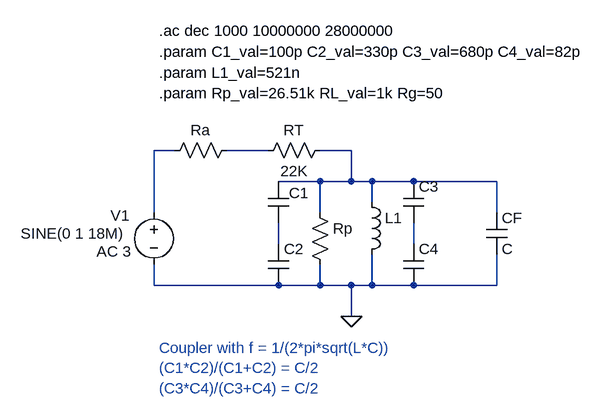
[diagram p0: schematic editable_coupler.asc]
editable_coupler.asc, the LTspice schematic file:
Version 4.1
SHEET 1 1576 680
WIRE 80 32 48 32
WIRE 224 32 160 32
WIRE 352 32 304 32
WIRE 304 80 240 80
WIRE 352 80 352 32
WIRE 352 80 304 80
WIRE 384 80 352 80
WIRE 448 80 384 80
WIRE 576 80 448 80
WIRE 384 112 384 80
WIRE 48 128 48 32
WIRE 304 128 304 80
WIRE 576 128 576 80
WIRE 240 176 240 144
WIRE 448 176 448 144
WIRE 48 240 48 208
WIRE 240 240 48 240
WIRE 304 240 304 208
WIRE 304 240 240 240
WIRE 352 240 304 240
WIRE 384 240 384 192
WIRE 384 240 352 240
WIRE 448 240 384 240
WIRE 576 240 576 192
WIRE 576 240 448 240
WIRE 352 288 352 240
FLAG 352 288 0
SYMBOL ind 368 96 R0
WINDOW 3 36 80 Invisible 2
SYMATTR Value 521n
SYMATTR InstName L1
SYMBOL cap 224 80 R0
WINDOW 0 32 18 Left 2
WINDOW 3 24 56 Invisible 2
SYMATTR InstName C1
SYMATTR Value 94.451p
SYMBOL cap 224 176 R0
WINDOW 3 24 56 Invisible 2
SYMATTR Value 364.183p
SYMATTR InstName C2
SYMBOL cap 432 80 R0
WINDOW 3 24 56 Invisible 2
SYMATTR Value 752.132p
SYMATTR InstName C3
SYMBOL cap 432 176 R0
WINDOW 3 24 56 Invisible 2
SYMATTR Value 83.307p
SYMATTR InstName C4
SYMBOL res 176 16 R90
WINDOW 0 0 56 VBottom 2
WINDOW 3 32 56 Invisible 2
SYMATTR InstName Ra
SYMATTR Value 50
SYMBOL voltage 48 112 R0
WINDOW 3 -205 48 Left 2
WINDOW 123 -88 76 Left 2
WINDOW 39 0 0 Left 0
WINDOW 0 -67 20 Left 2
SYMATTR Value SINE(0 1 18M)
SYMATTR Value2 AC 3
SYMATTR InstName V1
SYMBOL res 288 112 R0
WINDOW 3 36 76 Invisible 2
SYMATTR Value 1Meg
SYMATTR InstName Rp
SYMBOL res 320 16 R90
WINDOW 0 0 56 VBottom 2
WINDOW 3 32 56 VTop 2
SYMATTR InstName RT
SYMATTR Value 22K
SYMBOL cap 560 128 R0
SYMATTR InstName CF
TEXT 56 -152 Left 2 !.ac dec 1000 10000000 28000000
TEXT 56 -120 Left 2 !.param C1_val=100p C2_val=330p C3_val=680p C4_val=82p
TEXT 56 -88 Left 2 !.param L1_val=521n
TEXT 56 -56 Left 2 !.param Rp_val=26.51k RL_val=1k Rg=50
TEXT 56 336 Left 2 ;Coupler with f = 1/(2*pi*sqrt(L*C))\n(C1*C2)/(C1+C2) = C/2\n(C3*C4)/(C3+C4) = C/2

The netlist it stands for:
* editable_coupler.asc
L1 N003 0 521n
C1 N003 N004 94.451p
C2 N004 0 364.183p
C3 N003 N005 752.132p
C4 N005 0 83.307p
Ra N002 N001 50
V1 N001 0 SINE(0 1 18M) AC 3
Rp N003 0 1Meg
RT N003 N002 22K
CF N003 0 C
.ac dec 1000 10000000 28000000
.param C1_val=100p C2_val=330p C3_val=680p C4_val=82p
.param L1_val=521n
.param Rp_val=26.51k RL_val=1k Rg=50
* Coupler with f = 1/(2*pi*sqrt(L*C))
* (C1*C2)/(C1+C2) = C/2
* (C3*C4)/(C3+C4) = C/2
.backanno
.end